# EAGLE design Powerswitch dengan fitur reset  (EAGLE 9.6.2)
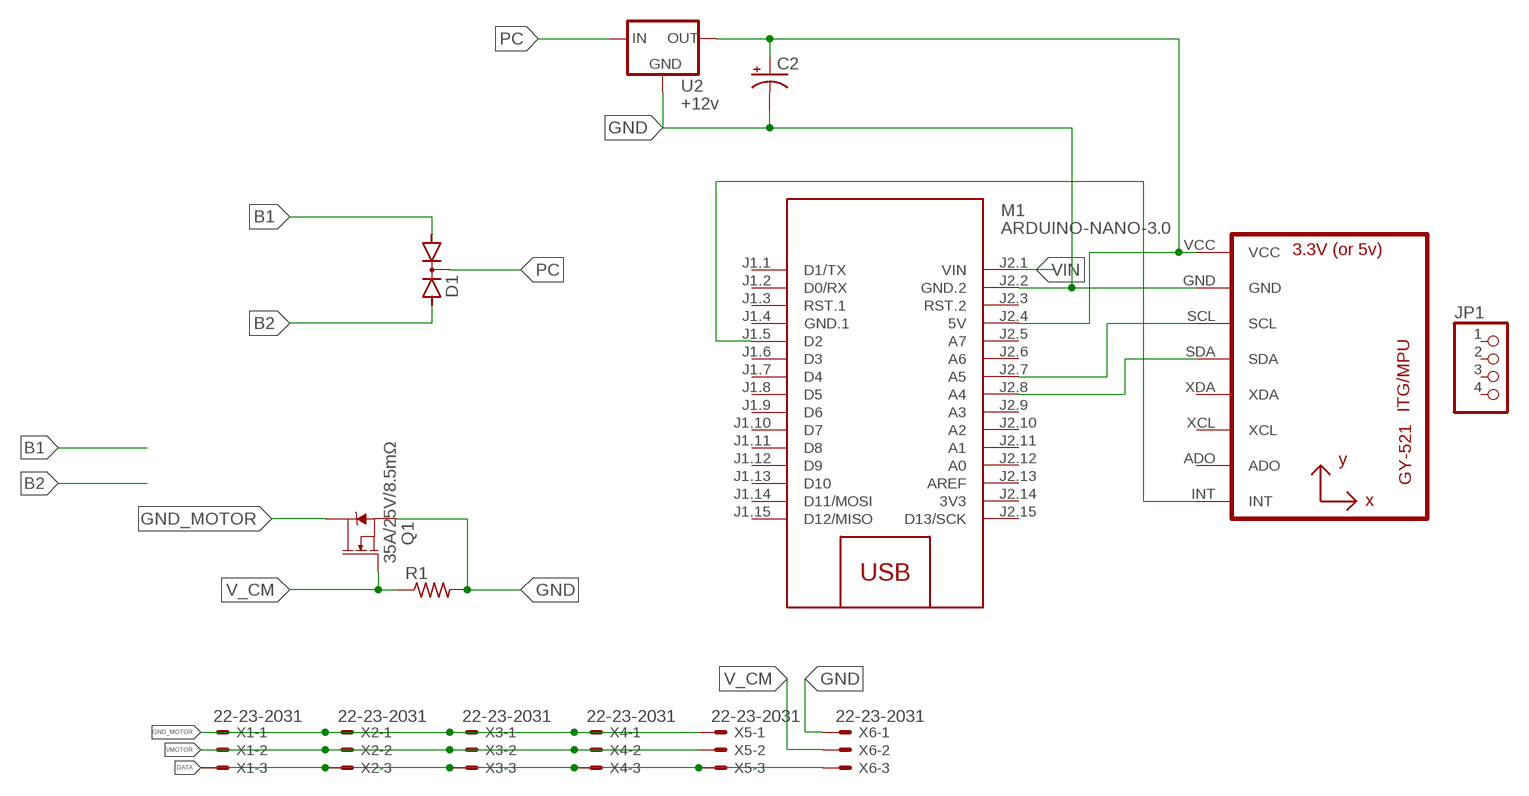
[diagram p0: schematic, sheet 1]

## Parts
C2  CPOL-USE2-5  [E2-5]
D1  DIODE-2AC|CATO220H  [TO220AB]
JP1  PINHD-1X4  [1X04]
M1  ARDUINO-NANO-3.0  [ARDUINO-NANO-3.0]
Q1  35A/25V/8.5mΩ  MOSFET-NCH-FDD8780  [DPAK]
R1  R-US_0207/10  [0207/10]
U1  GY-521MPU6050  [GY-521]
U2  +12v  V_REG_78XX7812  [TO-252]
X1  22-23-2031  [22-23-2031]
X2  22-23-2031  [22-23-2031]
X3  22-23-2031  [22-23-2031]
X4  22-23-2031  [22-23-2031]
X5  22-23-2031  [22-23-2031]
X6  22-23-2031  [22-23-2031]

## Nets
B1: D1.A1
B2: D1.A2
DATA: X1.3 X2.3 X3.3 X4.3 X5.3 X6.3
GND: C2.- M1.J2.2(GND.2) Q1.3(S) R1.2 U1.GND U2.3(GND) X6.1
GND_MOTOR: Q1.4(D) X1.1 X2.1 X3.1 X4.1 X5.1
N$4: M1.J2.8(A4) U1.SDA
N$6: M1.J2.7(A5) U1.SCL
N$9: M1.J1.5(D2) U1.INT
N$11: C2.+ M1.J2.4(5V) U1.VCC U2.2(OUT)
PC: D1.C U2.1(IN)
V_CM: Q1.1(G) R1.1 X6.2
VIN: M1.J2.1(VIN)
VMOTOR: X1.2 X2.2 X3.2 X4.2 X5.2
Unconnected: JP1.1 JP1.2 JP1.3 JP1.4 M1.J1.1(D1/TX) M1.J1.2(D0/RX) M1.J1.3(RST.1) M1.J1.6(D3) M1.J1.7(D4) M1.J1.8(D5) M1.J1.9(D6) M1.J1.10(D7) M1.J1.11(D8) M1.J1.12(D9) M1.J1.13(D10) M1.J1.14(D11/MOSI) M1.J1.15(D12/MISO) M1.J2.3(RST.2) M1.J2.5(A7) M1.J2.6(A6) M1.J2.9(A3) M1.J2.10(A2) M1.J2.11(A1) M1.J2.12(A0) M1.J2.13(AREF) M1.J2.15(D13/SCK) U1.ADO U1.XCL U1.XDA

## Power pins joined to a net without a drawn wire
3V3: M1.J2.14(3V3)
GND.1: M1.J1.4(GND.1)

## Library data of the parts
C2 = rcl:CPOL-US: POLARIZED CAPACITOR, American symbol; SPICEPREFIX: C
D1 = diode:DIODE-2AC|CA: Dual DIODE Anode-Cathode|Cathode-Anode
JP1 = pinhead:PINHD-1X4: PIN HEADER
M1 = diy-modules:ARDUINO-NANO-3.0: Arduino Nano 3.0 and compatible devices More details available here: https://www.arduino.cc/en/Main/ArduinoBoardNano Click here to find device on ebay.com <http://www.ebay.com/sch/arduino+nano>
Q1 = SparkFun-DiscreteSemi:MOSFET-NCH: N-channel MOSFETs Voltage controlled devices that allow control of high current outputs. SparkFun Products: SparkFun OpenScale <https://www.sparkfun.com/products/13261> SparkFun Digital Sandbox <https://www.sparkfun.com/products/12651> SparkFun Monster Moto Shield <https://www.sparkfun.com/products/10182> SparkFun MOSFET Power Controller <https://www.sparkfun.com/products/11214>; PROD_ID: TRANS-09984
R1 = rcl:R-US_: RESISTOR, American symbol; SPICEPREFIX: R
U1 = gy-521:GY-521
U2 = SparkFun-IC-Power:V_REG_78XX: Voltage Regulator Standard 78xx regulator. IGO (Input Ground Output). Spark Fun Electronics SKU : COM-00107; PROD_ID: VREG-12370
X1-X6 = con-molex:22-23-2031: .100" (2.54mm) Center Header - 3 Pin; MF: MOLEX; MPN: 22-23-2031; OC_FARNELL: 1462950; OC_NEWARK: 30C0862

## Board
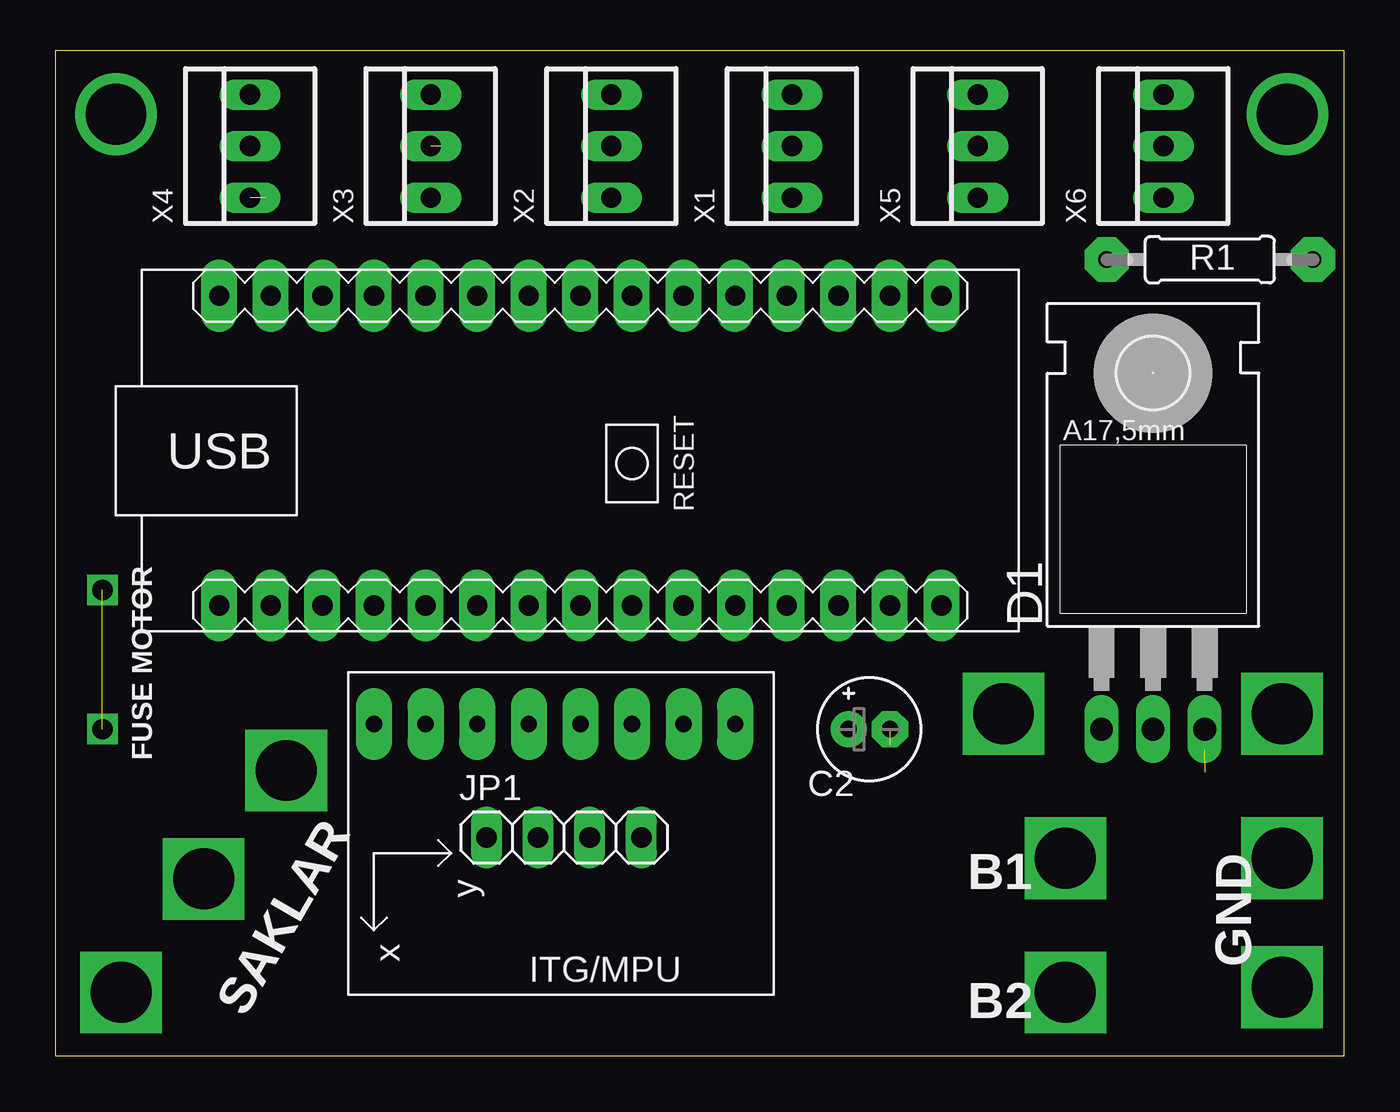
[diagram p1: board, top side]
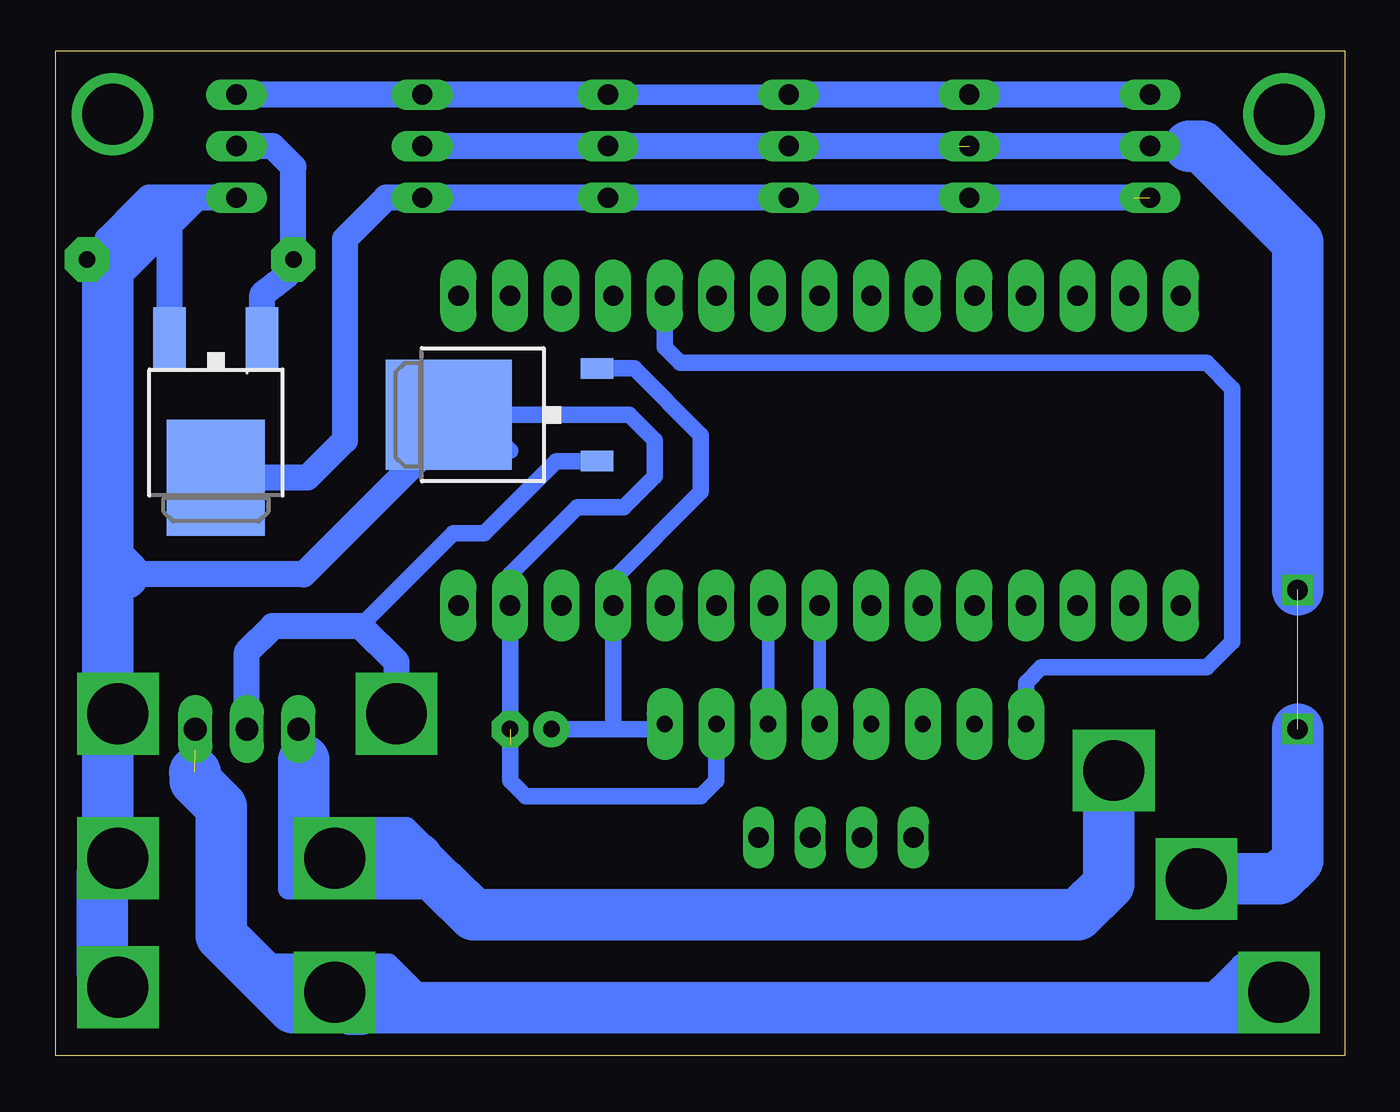
[diagram p2: board, bottom side, seen from below]

Size 63.46 x 49.46 mm. Coordinates in mm from the lower left corner, seen from the top.
Outline: 0,0 63.46,0 63.46,49.46 0,49.46 0,0
Copper layers (1*16): Top 0.035mm / dielectric 1.5mm / Bottom 0.035mm
Design rules "default": minimum track width 6mil, minimum drill 0.35mm, track to track 24mil, track to pad 24mil, pad to pad 24mil, via to via 24mil, smd to smd 24mil, copper to edge 40mil, drill to drill 6mil, minimum pad ring 10mil, minimum via ring 8mil, stop-mask expansion 4mil, vias tented up to drill 0mil, thermal gap 10mil

### Footprints (pad centres in the part's own frame; a part is rotated, then mirrored left to right if it is on the bottom)
E2-5 = drill 0.813 pad 1.778: + -1.016,0 | drill 0.813 pad 1.778 octagon: - 1.016,0
TO220AB = drill 1.118 long: A1 -2.54,-6.35; A2 2.54,-6.35; C 0,-6.35 | hole 0.025: 0,11.176
1X04 = drill 1.016 long: 1 -3.81,0; 2 -1.27,0; 3 1.27,0; 4 3.81,0
ARDUINO-NANO-3.0 = drill 1 pad 1.778 long: J1.1 17.78,7.62; J1.2 15.24,7.62; J1.3 12.7,7.62; J1.4 10.16,7.62; J1.5 7.62,7.62; J1.6 5.08,7.62; J1.7 2.54,7.62; J1.8 0,7.62; J1.9 -2.54,7.62; J1.10 -5.08,7.62; J1.11 -7.62,7.62; J1.12 -10.16,7.62; J1.13 -12.7,7.62; J1.14 -15.24,7.62; J1.15 -17.78,7.62; J2.1 17.78,-7.62; J2.2 15.24,-7.62; J2.3 12.7,-7.62; J2.4 10.16,-7.62; J2.5 7.62,-7.62; J2.6 5.08,-7.62; J2.7 2.54,-7.62; J2.8 0,-7.62; J2.9 -2.54,-7.62; J2.10 -5.08,-7.62; J2.11 -7.62,-7.62; J2.12 -10.16,-7.62; J2.13 -12.7,-7.62; J2.14 -15.24,-7.62; J2.15 -17.78,-7.62
DPAK = smd 1.6 x 3: 1 -2.28,-5.31; 3 2.28,-5.31 | smd 4.826 x 5.715: 4 0,1.588
0207/10 = drill 0.813 pad 2.184 octagon: 1 -5.08,0; 2 5.08,0
GY-521 = drill 0.8 pad 1.778 long: ADO -8.89,-6.35; GND -8.89,6.35; INT -8.89,-8.89; SCL -8.89,3.81; SDA -8.89,1.27; VCC -8.89,8.89; XCL -8.89,-3.81; XDA -8.89,-1.27
TO-252 = smd 1 x 1.6: 1 -2.28,-4.8; 2 2.28,-4.8 | smd 5.4 x 6.2: 3 0,2.5
22-23-2031 = drill 1 long: 1 -2.54,0; 2 0,0; 3 2.54,0

### Placement (x,y rotation side)
C2  40.08,16.06 0 top
D1  54.05,22.41 0 top
JP1  25.05,10.73 0 top
M1  25.86,29.78 0 top
Q1  55.58,30.03 180 bottom
R1  56.85,39.18 0 top
U1  24.59,7.43 270 top
U2  41.61,31.54 90 bottom
X1  36.27,44.77 90 top
X2  27.38,44.77 90 top
X3  18.49,44.77 90 top
X4  9.6,44.77 90 top
X5  45.42,44.77 90 top
X6  54.56,44.77 90 top

### Tracks (layer width: path | path; a pad name or v marks a point on that pad's centre or on a via)
B1  (via drill 3)
  Bottom 1.016: D1.A1 51.26,15.81 51.26,14.54 | 45.67,9.71 47.2,11.24 | 47.2,11.24 50.5,11.24 50.75,11.49 52.02,11.49 52.02,8.19 44.66,8.19 44.4,8.44 44.4,8.95 44.15,9.21 46.18,11.24 47.2,11.24
  Bottom 1.27: 51.51,10.22 51.01,9.71
  Bottom 2.54: v49.74,9.71 51.01,9.71 | v11.38,14.03 11.64,13.78 11.64,8.44 13.16,6.92 42.88,6.92 44.4,8.44 | v49.74,9.71 45.67,9.71 | 51.26,14.54 51.26,11.24 v49.74,9.71
B2  (via drill 3)  (1 unrouted)
  Bottom 1.016: 44.91,2.35 46.43,3.87 | 46.43,3.87 47.07,4.51 53.93,4.51 | 53.04,3.62 52.78,3.87 46.43,3.87
  Bottom 1.27: v49.74,3.11 50.5,2.35 | D1.A2 56.59,15.05 | 4.02,2.35 v3.25,3.11 | 7.06,2.35 5.03,4.38 1.98,4.38
  Bottom 2.54: 4.02,2.35 7.06,2.35 44.91,2.35 48.97,2.35 v49.74,3.11 48.91,2.29 48.47,2.29 | 56.61,13.94 56.59,13.92 56.59,13.52 55.32,12.25 55.32,5.9 53.93,4.51 53.04,3.62 51.77,2.35 50.5,2.35 48.67,2.35
DATA
  Bottom 1.016: X2.3 37.29,47.31
  Bottom 1.27: X4.3 X3.3 X2.3 | X1.3 37.29,47.31 X5.3 X6.3
GND  (via drill 3)  (1 unrouted)
  Bottom 0.813: 41.1,21.14 M1.J2.2 | M1.J2.2 40.97,22.03 40.97,20.99 | 42.6,30.03 U2.3 35.24,31.54 33.99,30.29 33.99,28.51 35.51,26.99 37.8,26.99 41.1,23.68 M1.J2.2 | 41.1,29.78 41.35,30.03 42.6,30.03 | 41.1,15.3 M1.J2.2 | 57.86,42.22 57.86,42.23 | 42.6,30.03 44.91,30.03 | R1.2 60.91,39.18 | U1.GND 30.94,13.52 31.7,12.76 40.34,12.76 41.1,13.52 C2.- | 60.91,10.22 v60.4,9.71
  Bottom 1.016: 56.09,42.23 56.33,42.23 57.86,40.7 58.11,40.45 58.87,40.45 | 59.26,41.84 58.75,41.34 59.01,41.34 59.9,40.45 59.64,40.45 | 59.64,40.45 60.91,39.18 60.4,39.18 59.13,40.45 | 59.64,40.45 59.13,40.45 | 57.86,39.43 58.5,40.07 | 58.5,40.07 58.87,40.45 | 58.87,40.45 59.13,40.45 | 60.91,37.65 58.5,40.07
  Bottom 1.27: X6.1 56.09,42.23 57.86,42.23 58.88,42.23 59.26,41.84 60.91,40.19 60.91,39.18 | Q1.3 57.86,39.43 57.86,40.7 57.86,42.22 | 44.91,30.03 51.26,23.68 60.15,23.68
  Bottom 2.54: 60.91,24.45 60.91,37.65 60.91,39.18 | v60.4,3.36 61.17,4.13 61.17,8.95 v60.4,9.71 | 60.91,24.45 60.15,23.68 | 60.91,10.22 60.91,16.32 v60.4,16.83 60.91,17.33 60.91,24.45
GND_MOTOR  (1 unrouted)
  Bottom 1.27: 10.37,42.23 X3.1 X2.1 X1.1 X5.1 47.2,42.23 49.23,40.19 49.23,30.29 51.07,28.45 Q1.4
N$1  (via drill 3 pad 3.1)
  other vias: 3,46.34
N$2  (via drill 3 pad 3.1)
  other vias: 60.66,46.34
N$4
  Bottom 0.61: M1.J2.8 U1.SDA
N$6
  Bottom 0.61: M1.J2.7 U1.SCL
N$9
  Bottom 0.813: U1.INT 15.7,18.35 14.94,19.11 6.81,19.11 5.54,20.38 5.54,32.83 6.81,34.1 32.72,34.1 33.48,34.86 M1.J1.5
N$11
  Bottom 0.61: 36.02,21.91 M1.J2.4
  Bottom 0.813: M1.J2.4 36.02,20.89 | 33.99,16.83 U1.VCC 33.59,16.06 C2.+ 36.02,16.06 M1.J2.4 | U2.2 34.98,33.82 31.7,30.54 31.7,27.75 36.02,23.43 M1.J2.4
PC  (via drill 3)
  Bottom 0.813: U2.1 38.82,29.26 42.37,25.72 43.89,25.72 48.47,21.14
  Bottom 1.27: D1.C 54.05,19.87 52.78,21.14 48.47,21.14 46.69,19.37 v46.69,16.83
V_CM
  Bottom 0.813: 52.02,38.47 52.02,39.18 R1.1
  Bottom 1.27: Q1.1 53.29,37.47 52.02,38.47 | R1.1 51.77,43.75 52.78,44.77 X6.2
VMOTOR  (via drill 1, 3)  (2 unrouted)
  Bottom 1.27: 19,44.77 X4.2 7.67,44.77 | X3.2 X2.2 X1.2 X5.2
  Bottom 2.54: v7.32,8.7 3.25,8.7 2.33,9.62 v2.33,16.06 | v2.33,22.92 2.33,40.03 7.06,44.77 7.67,44.77

### Text on the board
tPlace: B1 | GND | SAKLAR | B2
tNames: FUSE MOTOR